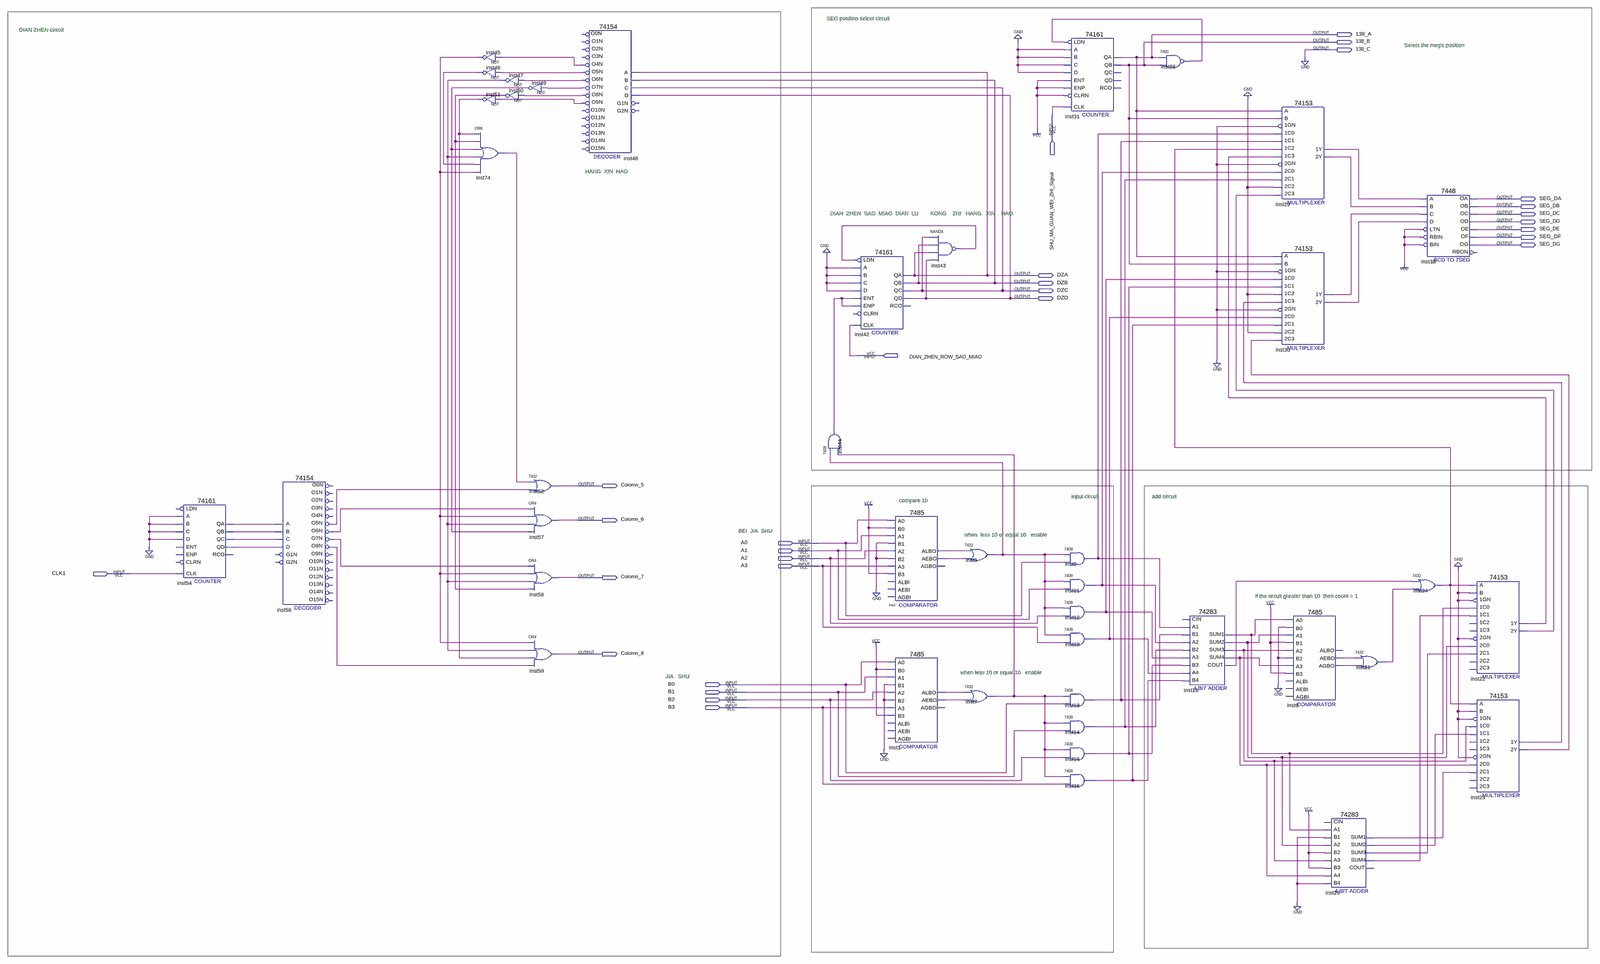
[diagram p0: schematic sheet, whole]
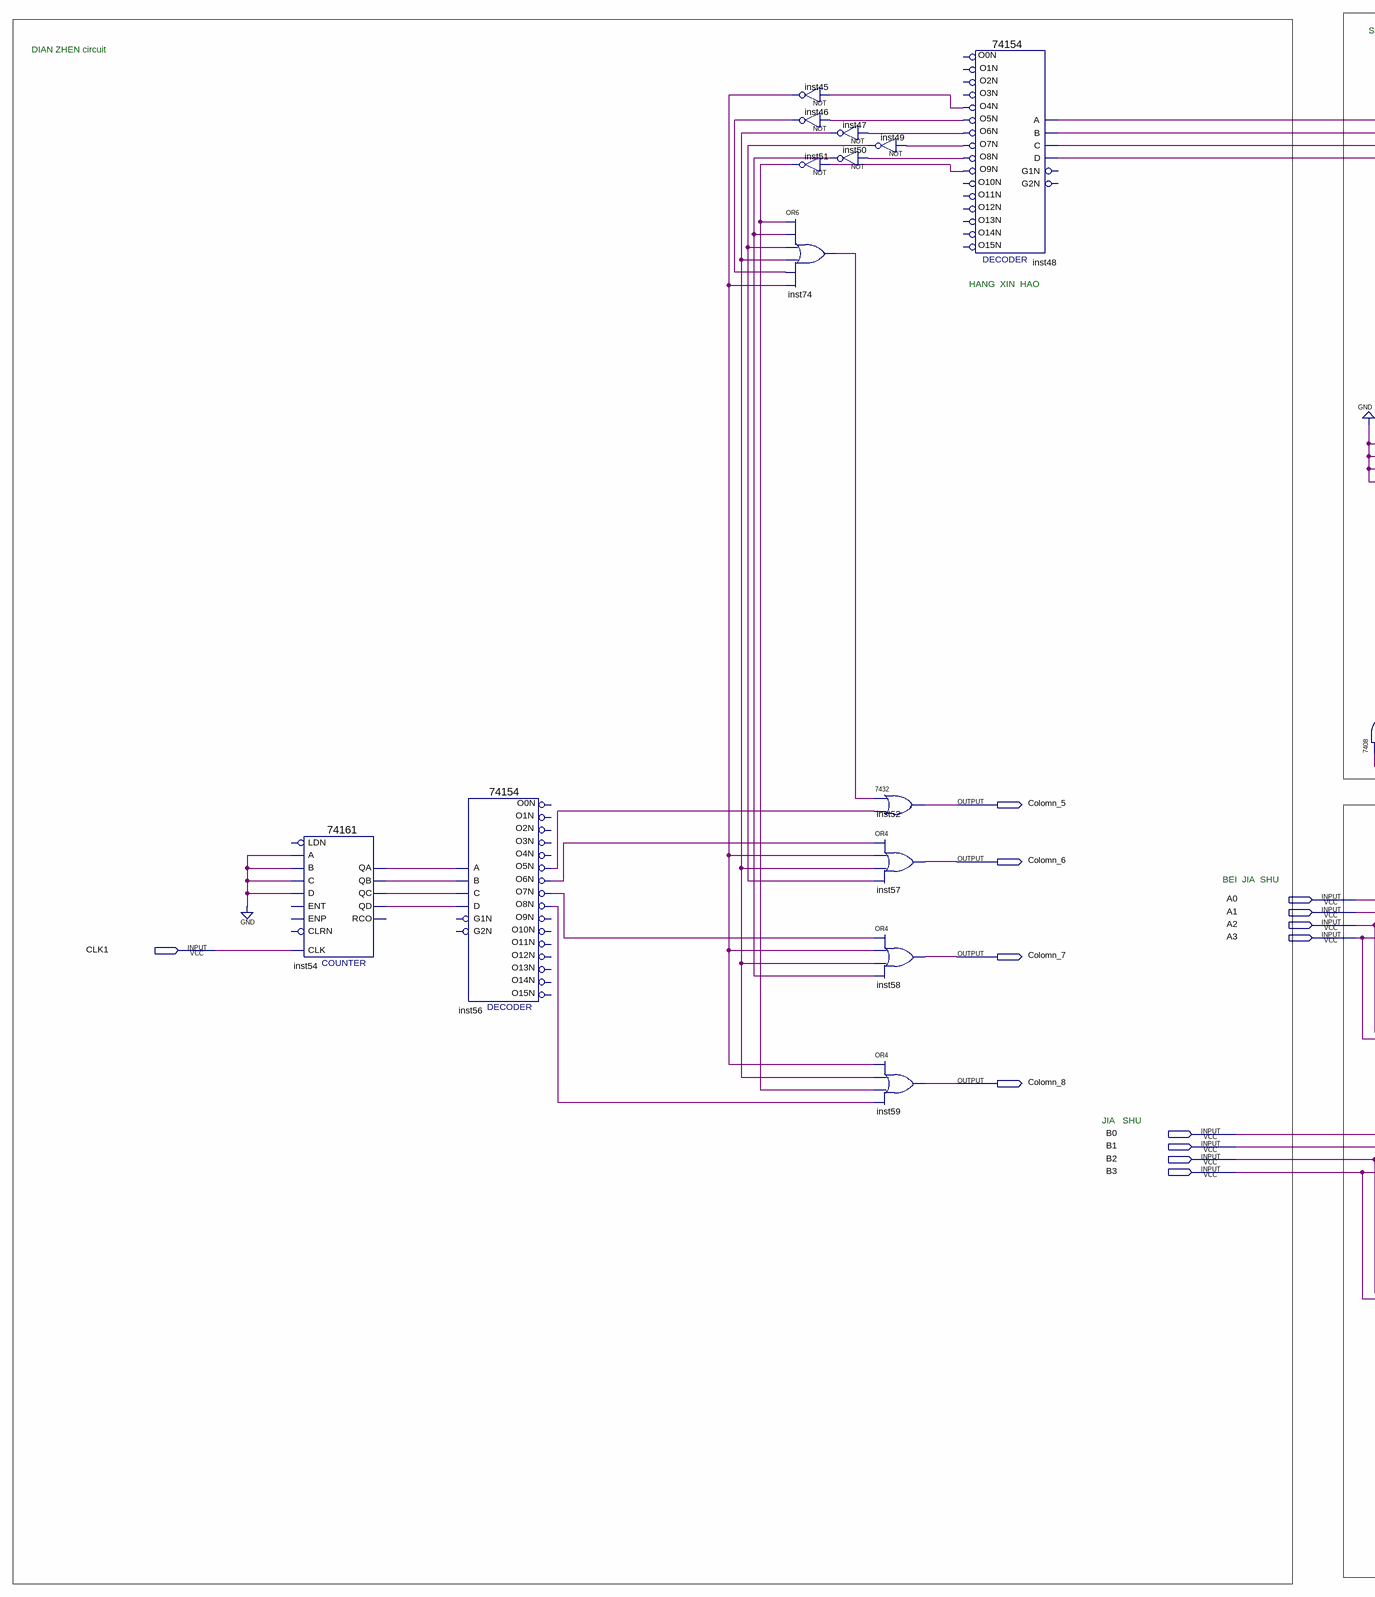
[diagram p1: schematic sheet, left part]
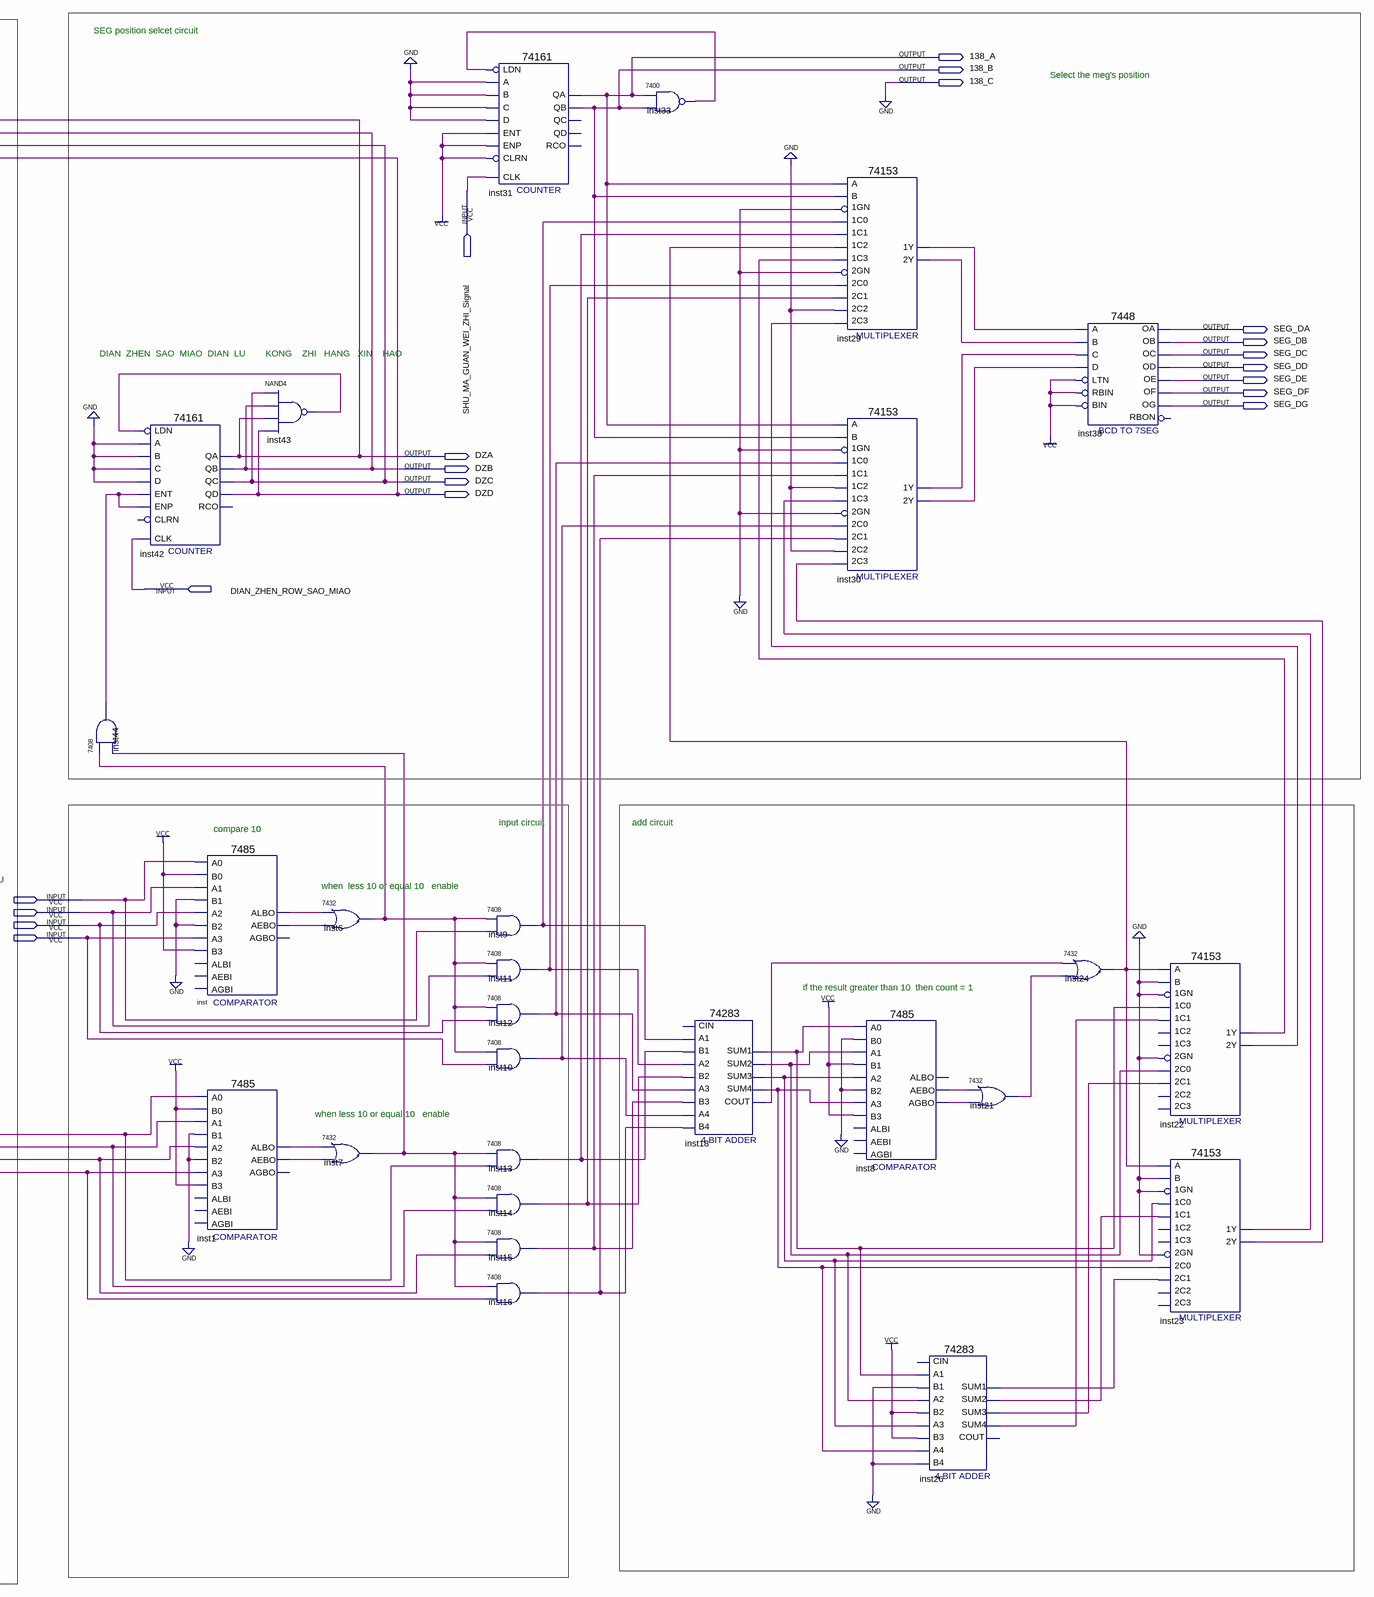
[diagram p2: schematic sheet, right part]
// Quartus schematic Dmeo.bdf as structural Verilog: 41 symbols, 29 pins
module Dmeo (
  input  SHU_MA_GUAN_WEI_ZHI_Signal,
  input  DIAN_ZHEN_ROW_SAO_MIAO,
  input  A0,
  input  A1,
  input  A2,
  input  A3,
  input  CLK1,
  input  B0,
  input  B1,
  input  B2,
  input  B3,
  output \138_A ,
  output \138_B ,
  output \138_C ,
  output SEG_DA,
  output SEG_DB,
  output SEG_DC,
  output SEG_DD,
  output SEG_DE,
  output SEG_DF,
  output SEG_DG,
  output DZA,
  output DZB,
  output DZC,
  output DZD,
  output Colomn_5,
  output Colomn_6,
  output Colomn_7,
  output Colomn_8
);

  wire inst1_aebo, inst1_albo, inst6_1, inst7_1, inst8_aebo, inst8_agbo, inst9_1, inst10_1, inst11_1,
       inst12_1, inst13_1, inst14_1, inst15_1, inst16_1, inst18_cout, inst18_sum1, inst18_sum2, inst18_sum3,
       inst18_sum4, inst21_1, inst22_1y, inst22_2y, inst23_1y, inst23_2y, inst24_1, inst26_sum1, inst26_sum2,
       inst26_sum3, inst26_sum4, inst29_1y, inst29_2y, inst30_1y, inst30_2y, inst33_1, inst43_out, inst44_1,
       inst45_out, inst46_out, inst47_out, inst48_o4n, inst48_o5n, inst48_o6n, inst48_o7n, inst48_o8n,
       inst48_o9n, inst49_out, inst50_out, inst51_out, inst54_qa, inst54_qb, inst54_qc, inst54_qd,
       inst56_o5n, inst56_o6n, inst56_o7n, inst56_o8n, inst74_out, inst_aebo, inst_albo;

  \74161  inst54 (
    .CLK(CLK1), .A(1'b0), .D(1'b0), .B(1'b0), .C(1'b0), .QD(inst54_qd), .QC(inst54_qc), .QB(inst54_qb),
    .QA(inst54_qa));  // open: CLRN, ENP, LDN, ENT, RCO
  \74154  inst56 (
    .C(inst54_qc), .D(inst54_qd), .B(inst54_qb), .A(inst54_qa), .O7N(inst56_o7n), .O6N(inst56_o6n),
    .O5N(inst56_o5n), .O8N(inst56_o8n));  // open: G1N, G2N, O0N, O12N, O15N, O10N, O11N, O1N, O13N, O14N, O4N, O3N, O2N, O9N
  or inst74 (inst74_out, inst51_out, inst50_out, inst49_out, inst47_out, inst46_out, inst45_out);
  not inst45 (inst45_out, inst48_o4n);
  not inst46 (inst46_out, inst48_o5n);
  not inst47 (inst47_out, inst48_o6n);
  not inst50 (inst50_out, inst48_o8n);
  not inst51 (inst51_out, inst48_o9n);
  not inst49 (inst49_out, inst48_o7n);
  \7432  inst52 (.\2 (inst74_out), .\3 (inst56_o5n), .\1 (Colomn_5));
  or inst57 (Colomn_6, inst56_o6n, inst45_out, inst47_out, inst49_out);
  or inst58 (Colomn_7, inst56_o7n, inst45_out, inst47_out, inst50_out);
  or inst59 (Colomn_8, inst45_out, inst47_out, inst51_out, inst56_o8n);
  \74154  inst48 (
    .C(DZC), .D(DZD), .B(DZB), .A(DZA), .O4N(inst48_o4n), .O7N(inst48_o7n), .O6N(inst48_o6n),
    .O5N(inst48_o5n), .O9N(inst48_o9n), .O8N(inst48_o8n));  // open: G1N, G2N, O0N, O12N, O15N, O10N, O11N, O1N, O13N, O14N, O3N, O2N
  \7408  inst44 (.\3 (inst7_1), .\2 (inst6_1), .\1 (inst44_1));
  \74161  inst42 (
    .CLK(DIAN_ZHEN_ROW_SAO_MIAO), .ENP(inst44_1), .LDN(inst43_out), .A(1'b0), .D(1'b0), .ENT(inst44_1),
    .B(1'b0), .C(1'b0), .QD(DZD), .QC(DZC), .QB(DZB), .QA(DZA));  // open: CLRN, RCO
  \7485  inst (
    .A3(A3), .B2(1'b0), .A2(A2), .A0(A0), .B0(1'b1), .B3(1'b1), .A1(A1), .B1(1'b0), .ALBO(inst_albo),
    .AEBO(inst_aebo));  // open: AEBI, AGBI, ALBI, AGBO
  \7485  inst1 (
    .A3(B3), .B2(1'b0), .A2(B2), .A0(B0), .B0(1'b1), .B3(1'b1), .A1(B1), .B1(1'b0), .ALBO(inst1_albo),
    .AEBO(inst1_aebo));  // open: AEBI, AGBI, ALBI, AGBO
  nand inst43 (inst43_out, DZC, DZB, DZA, DZD);
  \7432  inst6 (.\2 (inst_albo), .\3 (inst_aebo), .\1 (inst6_1));
  \7432  inst7 (.\2 (inst1_albo), .\3 (inst1_aebo), .\1 (inst7_1));
  \74161  inst31 (
    .CLRN(1'b1), .CLK(SHU_MA_GUAN_WEI_ZHI_Signal), .ENP(1'b1), .LDN(inst33_1), .A(1'b0), .D(1'b0),
    .ENT(1'b1), .B(1'b0), .C(1'b0), .QB(\138_B ), .QA(\138_A ));  // open: QD, QC, RCO
  \7408  inst9 (.\3 (A0), .\2 (inst6_1), .\1 (inst9_1));
  \7408  inst11 (.\3 (A1), .\2 (inst6_1), .\1 (inst11_1));
  \7408  inst12 (.\3 (A2), .\2 (inst6_1), .\1 (inst12_1));
  \7408  inst10 (.\3 (A3), .\2 (inst6_1), .\1 (inst10_1));
  \7408  inst13 (.\3 (B0), .\2 (inst7_1), .\1 (inst13_1));
  \7408  inst14 (.\3 (B1), .\2 (inst7_1), .\1 (inst14_1));
  \7408  inst15 (.\3 (B2), .\2 (inst7_1), .\1 (inst15_1));
  \7408  inst16 (.\3 (B3), .\2 (inst7_1), .\1 (inst16_1));
  \7400  inst33 (.\3 (\138_B ), .\2 (\138_A ), .\1 (inst33_1));
  \74283  inst18 (
    .A1(inst9_1), .A2(inst11_1), .B2(inst14_1), .A3(inst12_1), .A4(inst10_1), .B4(inst16_1), .B1(inst13_1),
    .B3(inst15_1), .SUM4(inst18_sum4), .COUT(inst18_cout), .SUM1(inst18_sum1), .SUM2(inst18_sum2),
    .SUM3(inst18_sum3));  // open: CIN
  \74153  inst29 (
    .\1C1 (inst13_1), .\1GN (1'b0), .\1C0 (inst9_1), .\2C0 (inst11_1), .\2GN (1'b0), .\2C2 (1'b0),
    .\1C2 (inst24_1), .\1C3 (inst22_1y), .B(\138_B ), .A(\138_A ), .\2C1 (inst14_1), .\2C3 (inst22_2y),
    .\1Y (inst29_1y), .\2Y (inst29_2y));
  \74153  inst30 (
    .\1C1 (inst15_1), .\1GN (1'b0), .\1C0 (inst12_1), .\2C0 (inst10_1), .\2GN (1'b0), .\2C2 (1'b0),
    .\1C2 (1'b0), .\1C3 (inst23_1y), .B(\138_B ), .A(\138_A ), .\2C1 (inst16_1), .\2C3 (inst23_2y),
    .\1Y (inst30_1y), .\2Y (inst30_2y));
  \7485  inst8 (
    .A3(inst18_sum4), .B2(1'b0), .A2(inst18_sum3), .A0(inst18_sum1), .B0(1'b0), .B3(1'b1), .A1(inst18_sum2),
    .B1(1'b1), .AGBO(inst8_agbo), .AEBO(inst8_aebo));  // open: AEBI, AGBI, ALBI, ALBO
  \74283  inst26 (
    .A1(inst18_sum1), .A2(inst18_sum2), .B2(1'b1), .A3(inst18_sum3), .A4(inst18_sum4), .B4(1'b0), .B1(1'b0),
    .B3(1'b1), .SUM4(inst26_sum4), .SUM1(inst26_sum1), .SUM2(inst26_sum2), .SUM3(inst26_sum3));  // open: CIN, COUT
  \7432  inst21 (.\2 (inst8_aebo), .\3 (inst8_agbo), .\1 (inst21_1));
  \7448  inst38 (
    .A(inst29_1y), .C(inst30_1y), .D(inst30_2y), .B(inst29_2y), .RBIN(1'b1), .BIN(1'b1), .LTN(1'b1),
    .OC(SEG_DC), .OE(SEG_DE), .OD(SEG_DD), .OF(SEG_DF), .OG(SEG_DG), .OB(SEG_DB), .OA(SEG_DA));  // open: RBON
  \7432  inst24 (.\2 (inst18_cout), .\3 (inst21_1), .\1 (inst24_1));
  \74153  inst22 (
    .\1C1 (inst26_sum4), .\1GN (1'b0), .\1C0 (inst18_sum1), .\2C0 (inst18_sum2), .\2GN (1'b0), .B(1'b0),
    .A(inst24_1), .\2C1 (inst26_sum3), .\1Y (inst22_1y), .\2Y (inst22_2y));  // open: 2C2, 1C2, 1C3, 2C3
  \74153  inst23 (
    .\1C1 (inst26_sum2), .\1GN (1'b0), .\1C0 (inst18_sum3), .\2C0 (inst18_sum4), .\2GN (1'b0), .B(1'b0),
    .A(inst24_1), .\2C1 (inst26_sum1), .\1Y (inst23_1y), .\2Y (inst23_2y));  // open: 2C2, 1C2, 1C3, 2C3

  assign \138_C  = 1'b0;

  // Notes on the sheet:
  //   SEG position selcet circuit
  //   DIAN ZHEN circuit
  //   Select the meg's position
  //   HANG  XIN  HAO 
  //   DIAN  ZHEN  SAO  MIAO  DIAN  LU        KONG    ZHI   HANG   XIN    HAO   
  //   input circuit
  //   add circuit
  //   compare 10
  //   BEI  JIA  SHU 
  //   when  less 10 or equal 10   enable
  //   if the result greater than 10  then count = 1 
  //   when less 10 or equal 10   enable
  //   JIA   SHU  
endmodule
